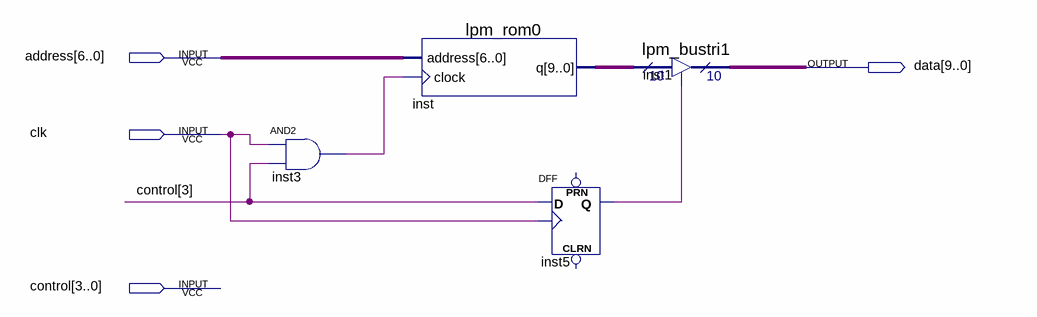
[diagram p0: schematic sheet]
// Quartus schematic ROM.bdf as structural Verilog: 4 symbols, 4 pins
module ROM (
  input  [6:0] address,
  input  clk,
  input  [3:0] control,
  output [9:0] data
);

  wire inst3_out, inst5_q;
  wire [9:0] inst_q;

  and inst3 (inst3_out, clk, control[3]);
  lpm_rom0 inst (.address(address), .clock(inst3_out), .q(inst_q));
  DFF inst5 (.CLK(clk), .D(control[3]), .Q(inst5_q));  // open: CLRN, PRN
  lpm_bustri1 inst1 (.enabledt(inst5_q), .data(inst_q), .tridata(data));
endmodule
